# EAGLE design WirelessTransceiverUSB_RevA (EAGLE 9.6.2)

## Sheet 1 of 2
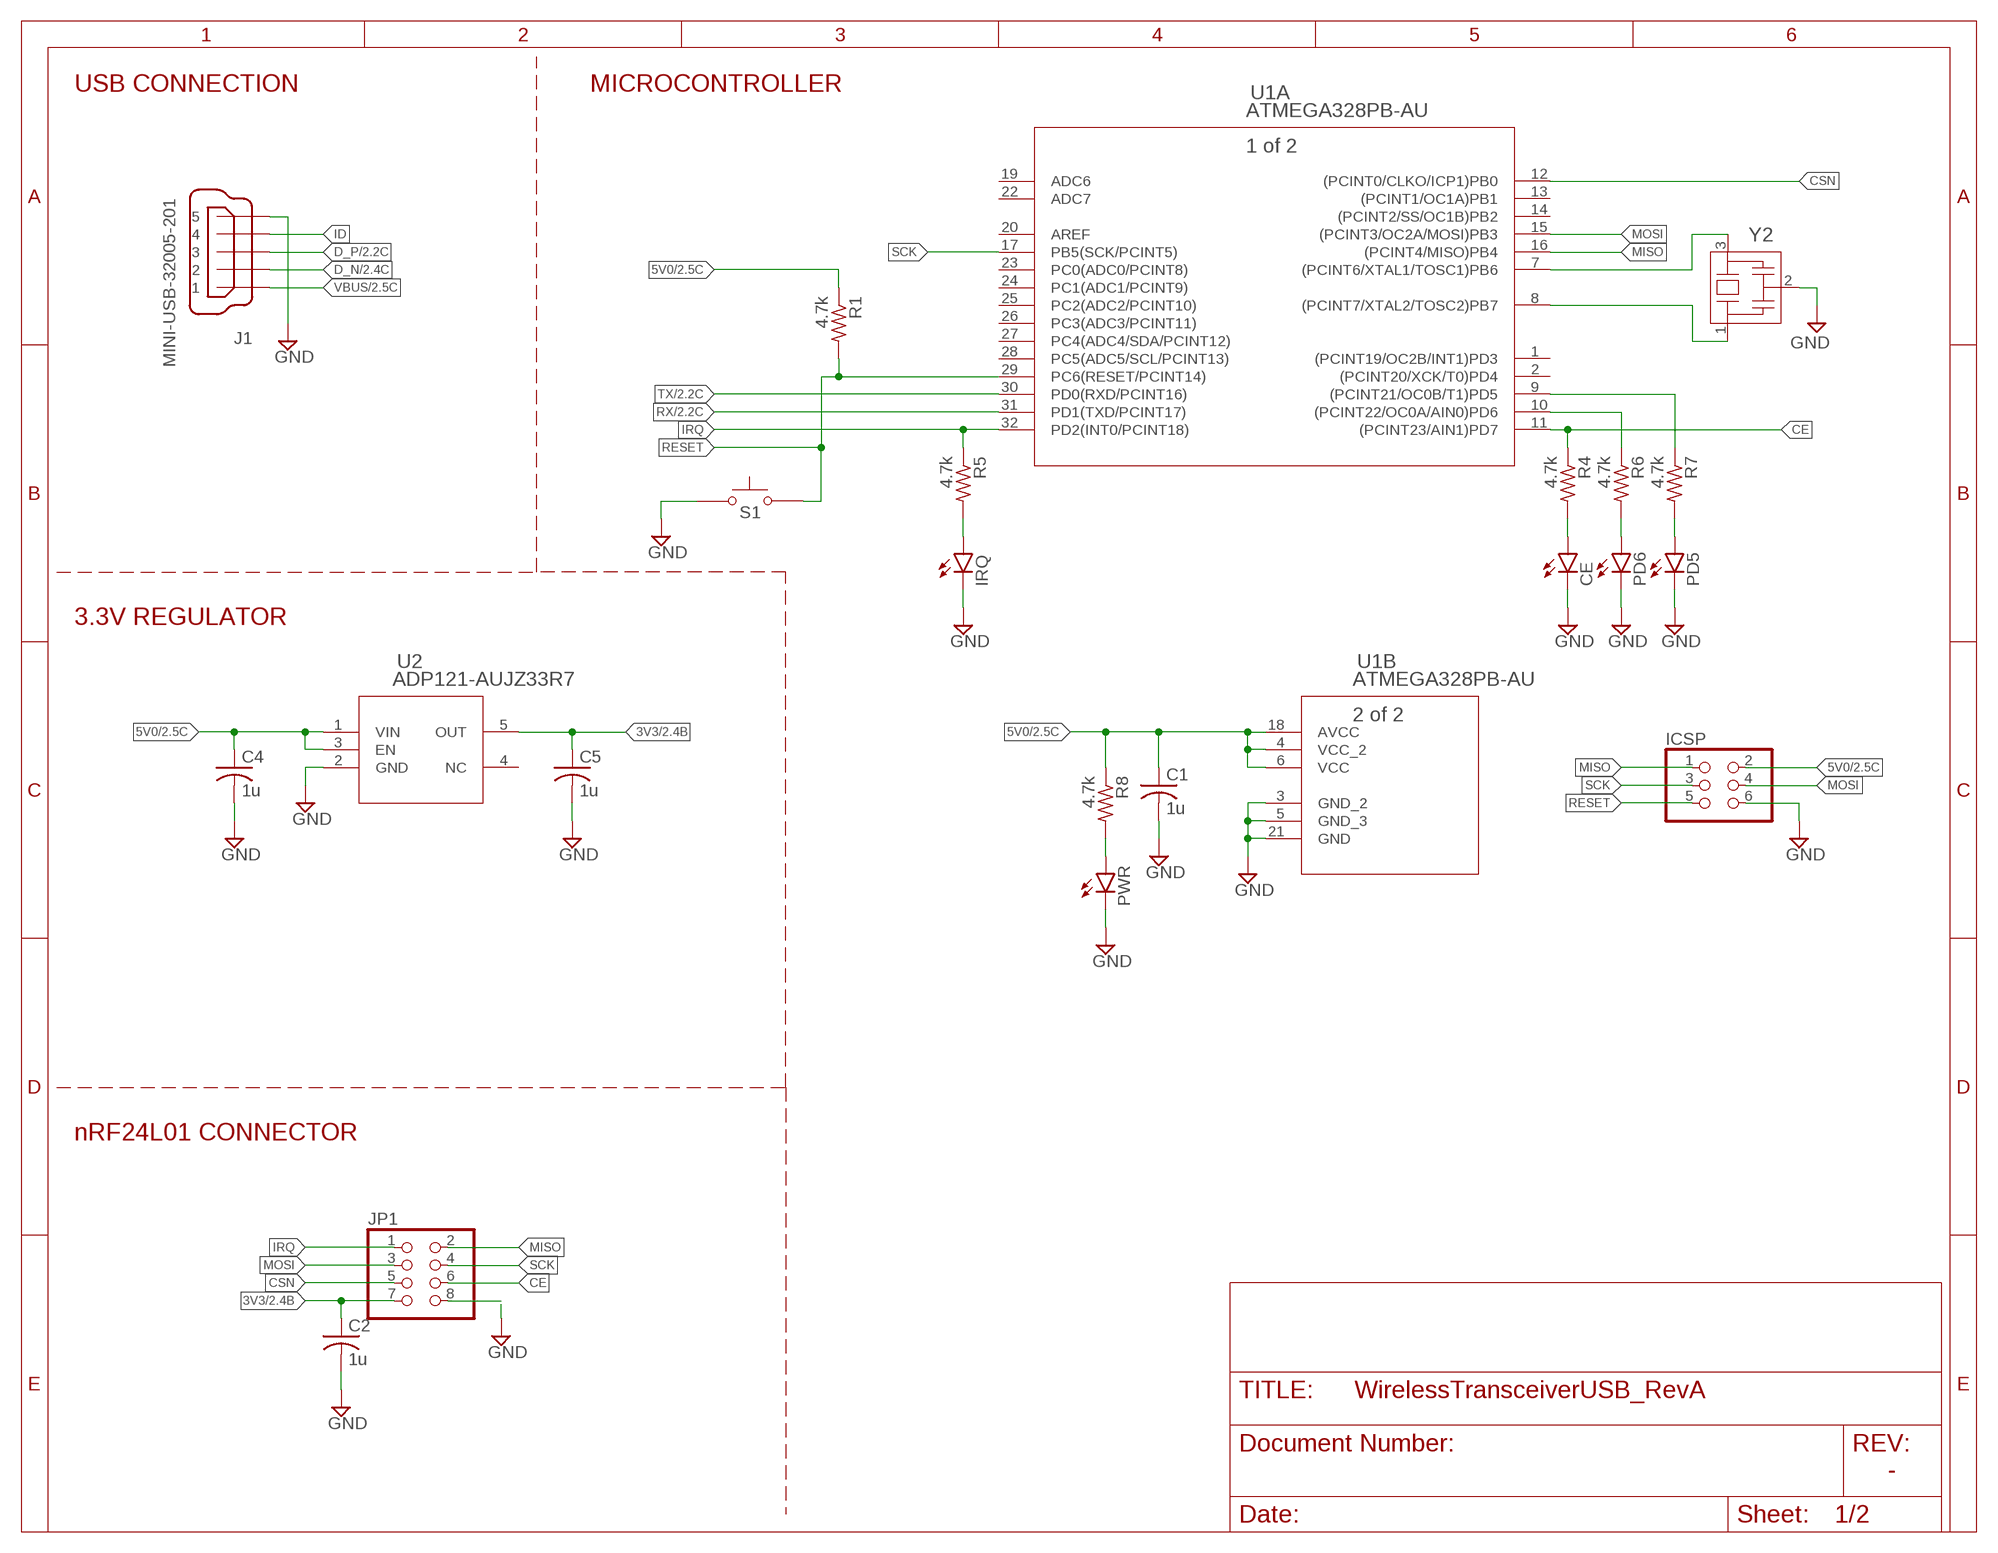
[diagram p0: schematic, sheet 1]

### Parts
C1  1u  C-USC0805  [C0805]
C2  1u  C-USC0805  [C0805]
C4  1u  C-USC0805  [C0805]
C5  1u  C-USC0805  [C0805]
CE  LEDSML0805  [SML0805]
ICSP  PINHD-2X3  [2X03]
IRQ  LEDSML0805  [SML0805]
J1  MINI-USB-32005-201  [32005-201]
JP1  PINHD-2X4  [2X04]
PD5  LEDSML0805  [SML0805]
PD6  LEDSML0805  [SML0805]
PWR  LEDSML0805  [SML0805]
R1  4.7k  R-US_R0805  [R0805]
R4  4.7k  R-US_R0805  [R0805]
R5  4.7k  R-US_R0805  [R0805]
R6  4.7k  R-US_R0805  [R0805]
R7  4.7k  R-US_R0805  [R0805]
R8  4.7k  R-US_R0805  [R0805]
S1  TL3315NF100Q  [SW_TL3315NF100Q]
U1  ATMEGA328PB-AU  [32A_MCH]
U2  ADP121-AUJZ33R7  [UJ_5_ADI]
Y2  CSTNE16M0V530000R0  [CSTNE16M0V530000R0_MUR]

### Nets
3V3: C2.1 C5.1 JP1.7 U2.5(OUT) ; also sheet 2
5V0: C1.1 C4.1 ICSP.2 R1.1 R8.1 U1.4(B:VCC_2) U1.6(B:VCC) U1.18(B:AVCC) U2.1(VIN) U2.3(EN) ; also sheet 2
CE: JP1.6 R4.1 U1.11(A:(PCINT23/AIN1)PD7)
CSN: JP1.5 U1.12(A:(PCINT0/CLKO/ICP1)PB0)
D_N [diff]: J1.2 ; also sheet 2
D_P [diff]: J1.3 ; also sheet 2
GND: C1.2 C2.2 C4.2 C5.2 CE.C ICSP.6 IRQ.C J1.5 JP1.8 PD5.C PD6.C PWR.C S1.1 S1.2 U1.3(B:GND_2) U1.5(B:GND_3) U1.21(B:GND) U2.2(GND) Y2.2 ; also sheet 2
ID: J1.4
IRQ: JP1.1 R5.1 U1.32(A:PD2(INT0/PCINT18))
MISO: ICSP.1 JP1.2 U1.16(A:(PCINT4/MISO)PB4)
MOSI: ICSP.4 JP1.3 U1.15(A:(PCINT3/OC2A/MOSI)PB3)
N$2: U1.7(A:(PCINT6/XTAL1/TOSC1)PB6) Y2.3
N$3: U1.8(A:(PCINT7/XTAL2/TOSC2)PB7) Y2.1
N$5: CE.A R4.2
N$6: IRQ.A R5.2
N$7: PD5.A R7.2
N$8: PD6.A R6.2
N$9: PWR.A R8.2
PD5: R7.1 U1.9(A:(PCINT21/OC0B/T1)PD5)
PD6: R6.1 U1.10(A:(PCINT22/OC0A/AIN0)PD6)
RESET: ICSP.5 R1.2 S1.3 S1.4 U1.29(A:PC6(RESET/PCINT14))
RX: U1.31(A:PD1(TXD/PCINT17)) ; also sheet 2
SCK: ICSP.3 JP1.4 U1.17(A:PB5(SCK/PCINT5))
TX: U1.30(A:PD0(RXD/PCINT16)) ; also sheet 2
VBUS: J1.1 ; also sheet 2
Unconnected: U1.1(A:(PCINT19/OC2B/INT1)PD3) U1.2(A:(PCINT20/XCK/T0)PD4) U1.13(A:(PCINT1/OC1A)PB1) U1.14(A:(PCINT2/SS/OC1B)PB2) U1.19(A:ADC6) U1.20(A:AREF) U1.22(A:ADC7) U1.23(A:PC0(ADC0/PCINT8)) U1.24(A:PC1(ADC1/PCINT9)) U1.25(A:PC2(ADC2/PCINT10)) U1.26(A:PC3(ADC3/PCINT11)) U1.27(A:PC4(ADC4/SDA/PCINT12)) U1.28(A:PC5(ADC5/SCL/PCINT13)) U2.4(NC)

### Notes on the sheet
- USB CONNECTION | MICROCONTROLLER
- 3.3V REGULATOR
- nRF24L01 CONNECTOR
- -

## Sheet 2 of 2
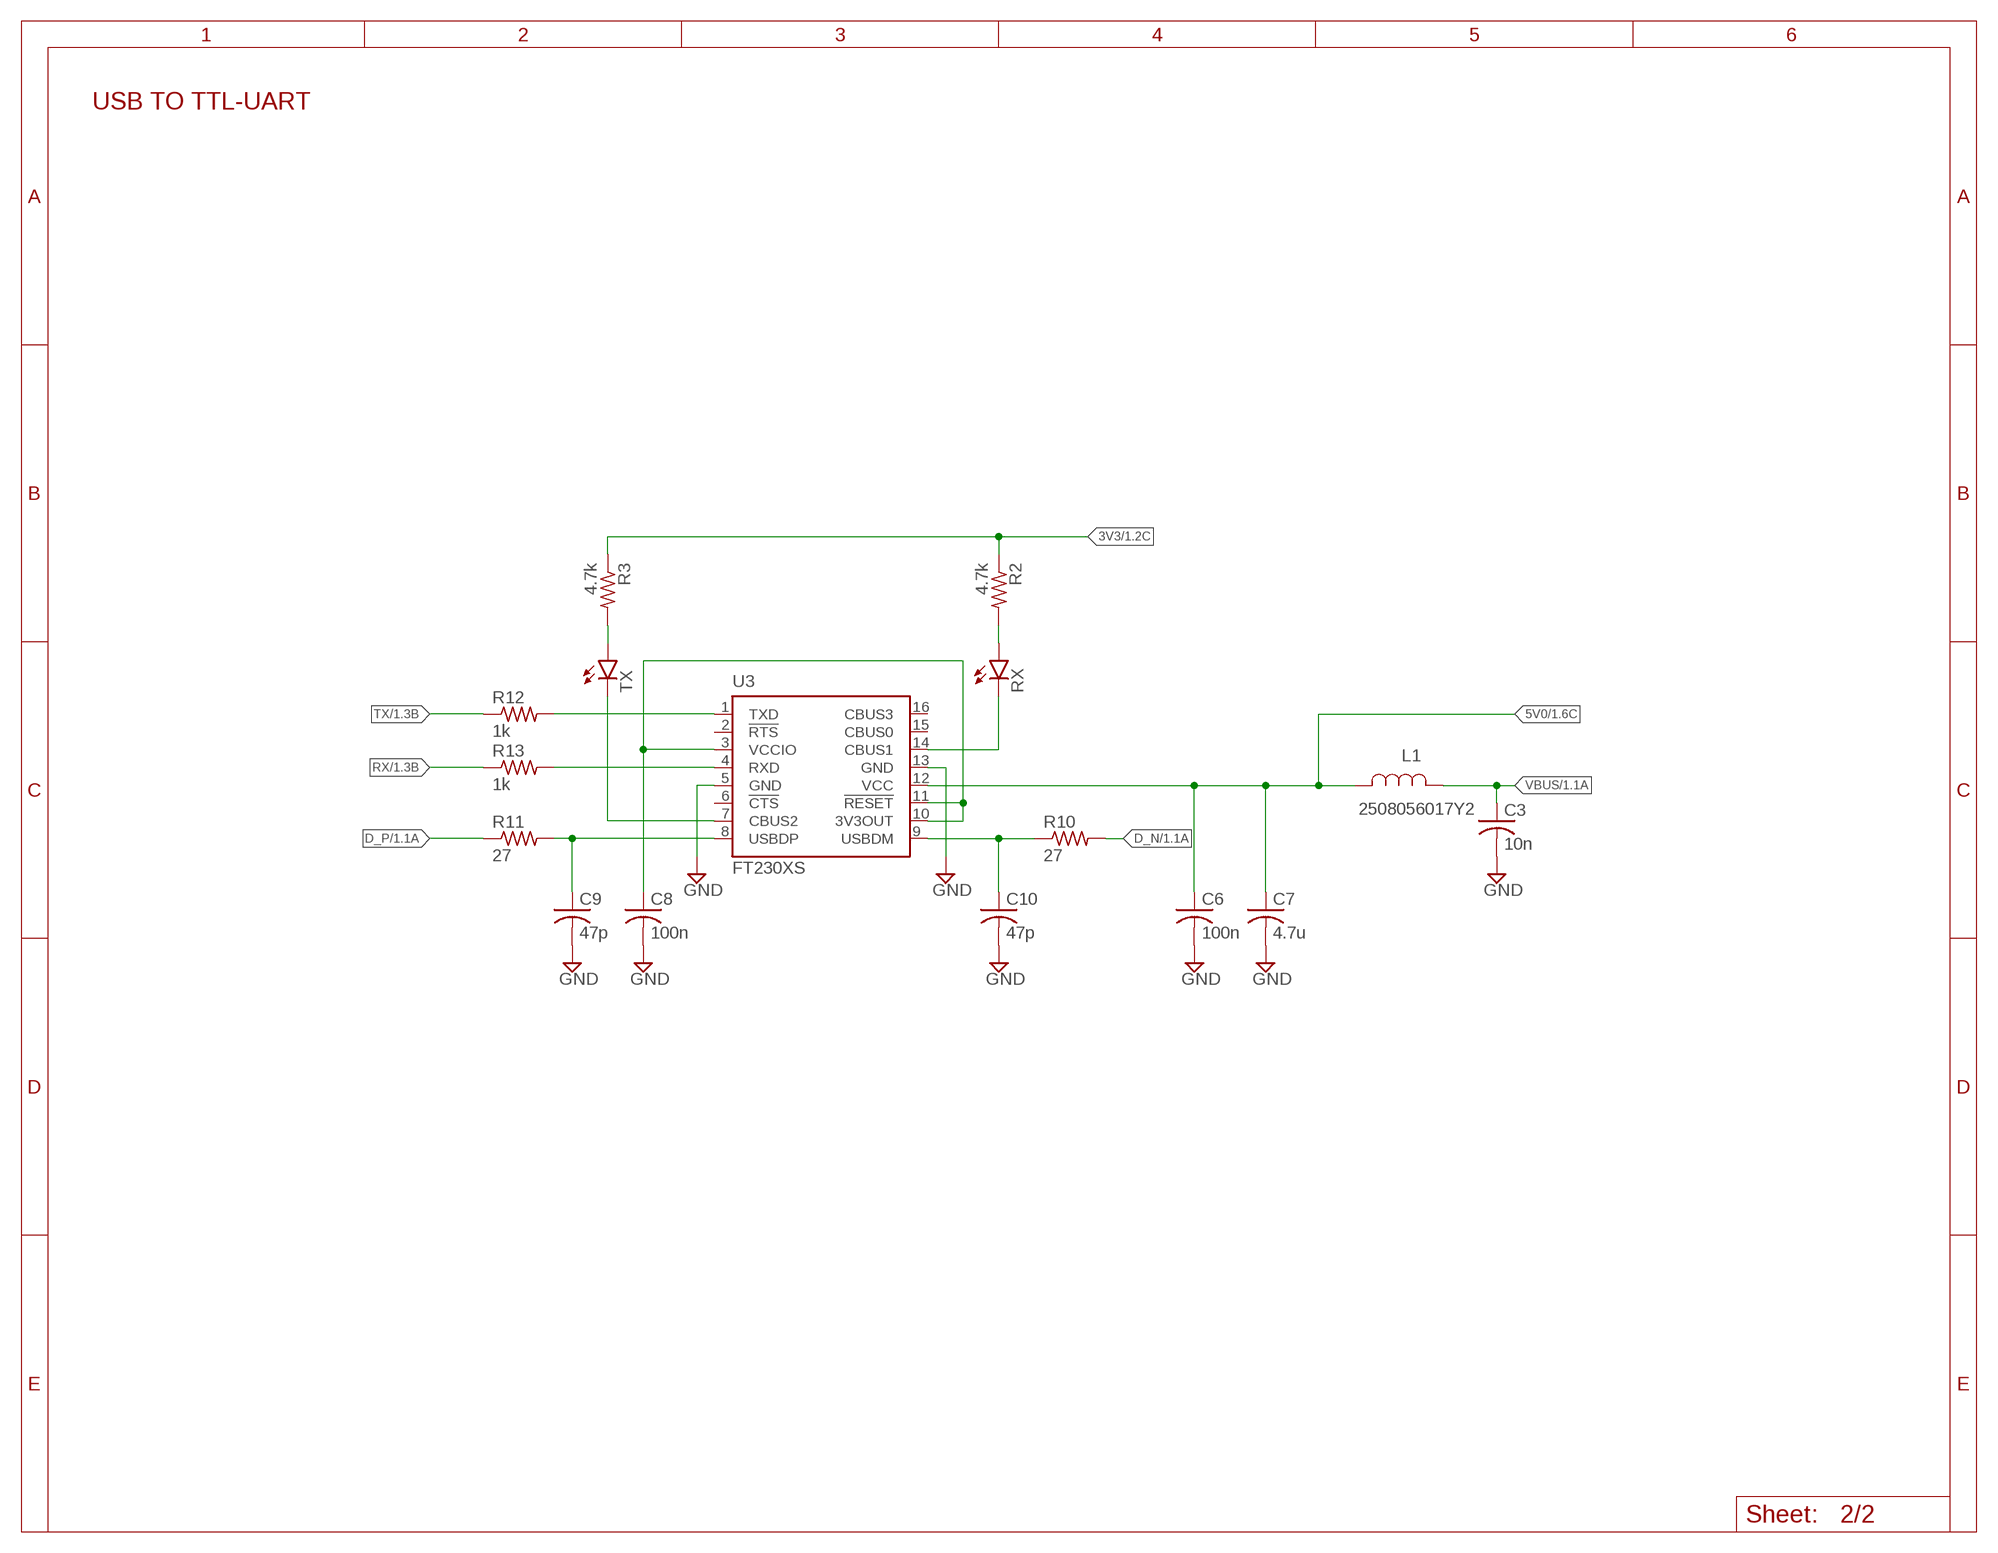
[diagram p1: schematic, sheet 2]

### Parts
C3  10n  C-USC0805  [C0805]
C6  100n  C-USC0805  [C0805]
C7  4.7u  C-USC0805  [C0805]
C8  100n  C-USC0805  [C0805]
C9  47p  C-USC0603  [C0603]
C10  47p  C-USC0603  [C0603]
L1  2508056017Y2  [IND_25_0805_FRT]
R2  4.7k  R-US_R0805  [R0805]
R3  4.7k  R-US_R0805  [R0805]
R10  27  R-US_R0603  [R0603]
R11  27  R-US_R0603  [R0603]
R12  1k  R-US_R0805  [R0805]
R13  1k  R-US_R0805  [R0805]
RX  LEDSML0805  [SML0805]
TX  LEDSML0805  [SML0805]
U3  FT230XS  [SSOP16]

### Nets
3V3: R2.1 R3.1 ; also sheet 1
5V0: C6.1 C7.1 L1.2 U3.12(VCC) ; also sheet 1
D_N [diff]: R10.2 ; also sheet 1
D_P [diff]: R11.1 ; also sheet 1
GND: C3.2 C6.2 C7.2 C8.2 C9.2 C10.2 U3.5(GND) U3.13(GND) ; also sheet 1
N$1: R2.2 RX.A
N$4: R3.2 TX.A
N$11: C8.1 U3.3(VCCIO) U3.10(3V3OUT) U3.11(!RESET)
N$13: TX.C U3.7(CBUS2)
N$14: RX.C U3.14(CBUS1)
N$15: R12.2 U3.1(TXD)
N$16: R13.2 U3.4(RXD)
RX: R13.1 ; also sheet 1
TX: R12.1 ; also sheet 1
USBD_N [diff]: C10.1 R10.1 U3.9(USBDM)
USBD_P [diff]: C9.1 R11.2 U3.8(USBDP)
VBUS: C3.1 L1.1 ; also sheet 1
Unconnected: U3.2(!RTS) U3.6(!CTS) U3.15(CBUS0) U3.16(CBUS3)

### Notes on the sheet
- USB TO TTL-UART
- Sheet:

## Library data of the parts
C1-C10 = rcl:C-US: CAPACITOR, American symbol
CE IRQ PD5 PD6 PWR RX TX = led:LED: LED OSRAM: - CHIPLED LG R971, LG N971, LY N971, LG Q971, LY Q971, LO R971, LY R971 LH N974, LH R974 LS Q976, LO Q976, LY Q976 LO Q996 - Hyper CHIPLED LW Q18S LB Q993, LB Q99A, LB R99A - SideLED LS A670, LO A670, LY A670, LG A670, LP A670 LB A673, LV A673, LT A673, LW A673 LH A674 LY A675 LS A676, LA A676, LO A676, LY A676, LW A676 LS A679, LY A679, LG A679 - Hyper Micro SIDELED® LS Y876, LA Y876, LO Y876, LY Y876 LT Y87S - SmartLED LW L88C, LW L88S LB L89C, LB L89S, LG L890 LS L89K, LO L89K, LY L89K LS L896, LA L896, LO L896, LY L896 - TOPLED LS T670, LO T670, LY T670, LG T670, LP T670 LSG T670, LSP T670, LSY T670, LOP T670, LYG T670 LG T671, LOG T671, LSG T671 LB T673, LV T673, LT T673, LW T673 LH T674 LS T676, LA T676, LO T676, LY T676, LB T676, LH T676, LSB T676, LW T676 LB T67C, LV T67C, LT T67C, LS T67K, LO T67K, LY T67K, LW E67C LS E67B, LA E67B, LO E67B, LY E67B, LB E67C, LV E67C, LT E67C LW T67C LS T679, LY T679, LG T679 LS T770, LO T770, LY T770, LG T770, LP T770 LB T773, LV T773, LT T773, LW T773 LH T774 LS E675, LA E675, LY E675, LS T675 LS T776, LA T776, LO T776, LY T776, LB T776 LHGB T686 LT T68C, LB T68C - Hyper Mini TOPLED® LB M676 - Mini TOPLED Santana® LG M470 LS M47K, LO M47K, LY M47K Source: http://www.osram.convergy.de LUXEON: - LUMILED® LXK2-PW12-R00, LXK2-PW12-S00, LXK2-PW14-U00, LXK2-PW14-V00 LXK2-PM12-R00, LXK2-PM12-S00, LXK2-PM14-U00 LXK2-PE12-Q00, LXK2-PE12-R00, LXK2-PE12-S00, LXK2-PE14-T00, LXK2-PE14-U00 LXK2-PB12-K00, LXK2-PB12-L00, LXK2-PB12-M00, LXK2-PB14-N00, LXK2-PB14-P00, LXK2-PB14-Q00 LXK2-PR12-L00, LXK2-PR12-M00, LXK2-PR14-Q00, LXK2-PR14-R00 LXK2-PD12-Q00, LXK2-PD12-R00, LXK2-PD12-S00 LXK2-PH12-R00, LXK2-PH12-S00 LXK2-PL12-P00, LXK2-PL12-Q00, LXK2-PL12-R00 Source: www.luxeon.com KINGBRIGHT: KA-3528ASYC Source: www.kingbright.com
ICSP = pinhead:PINHD-2X3: PIN HEADER
J1 = con-cypressindustries:MINI-USB-: MINI USB-B Conector Source: www.cypressindustries.com; OC_FARNELL: unknown; OC_NEWARK: unknown
JP1 = pinhead:PINHD-2X4: PIN HEADER
L1 = rcl:2508056017Y2; COPYRIGHT: Copyright (C) 2023 Ultra Librarian. All rights reserved.; MANUFACTURER_PART_NUMBER: 2508056017Y2; MFR_NAME: Fair-Rite
R1-R8 R10-R13 = rcl:R-US_: RESISTOR, American symbol
S1 = TL3315NF100Q:TL3315NF100Q: Tactile Switch SPST-NO Top Actuated Surface Mount Check prices <https://pricing.snapeda.com/parts/TL3315NF100Q/E-Switch/view-part?ref=eda> Check prices <https://pricing.snapeda.com/parts/TL3315NF100Q/E-Switch/view-part?ref=eda> Check availability <https://pricing.snapeda.com/parts/TL3315NF100Q/E-Switch/view-part?ref=eda>; AVAILABILITY: In Stock; DESCRIPTION: Tactile Switch SPST-NO Top Actuated Surface Mount; MF: E-Switch; MP: TL3315NF100Q; PACKAGE: None; PRICE: None; PURCHASE-URL: https://pricing.snapeda.com/search/part/TL3315NF100Q/?ref=eda
U1 = microchip:ATMEGA328PB-AU; COPYRIGHT: Copyright (C) 2023 Ultra Librarian. All rights reserved.; MANUFACTURER_PART_NUMBER: ATMEGA328PB-AU; MFR_NAME: Microchip
U2 = linear:ADP121-AUJZ33R7; COPYRIGHT: Copyright (C) 2023 Ultra Librarian. All rights reserved.; MANUFACTURER_PART_NUMBER: ADP121-AUJZ33R7; MFR_NAME: Analog Devices Inc
U3 = ftdichip:FT230X: USB to BASIC UART IC Auto generated by make-symbol-device-package-bsdl.ulp Rev. 43 Source: Data sheet <http://www.ftdichip.com/Support/Documents/DataSheets/ICs/DS_FT230X.pdf>
Y2 = murata:CSTNE16M0V530000R0; COPYRIGHT: Copyright (C) 2023 Ultra Librarian. All rights reserved.; MANUFACTURER_PART_NUMBER: CSTNE16M0V530000R0; MFR_NAME: Murata

## Net classes
1 diff: width 0.152 mm

## Board
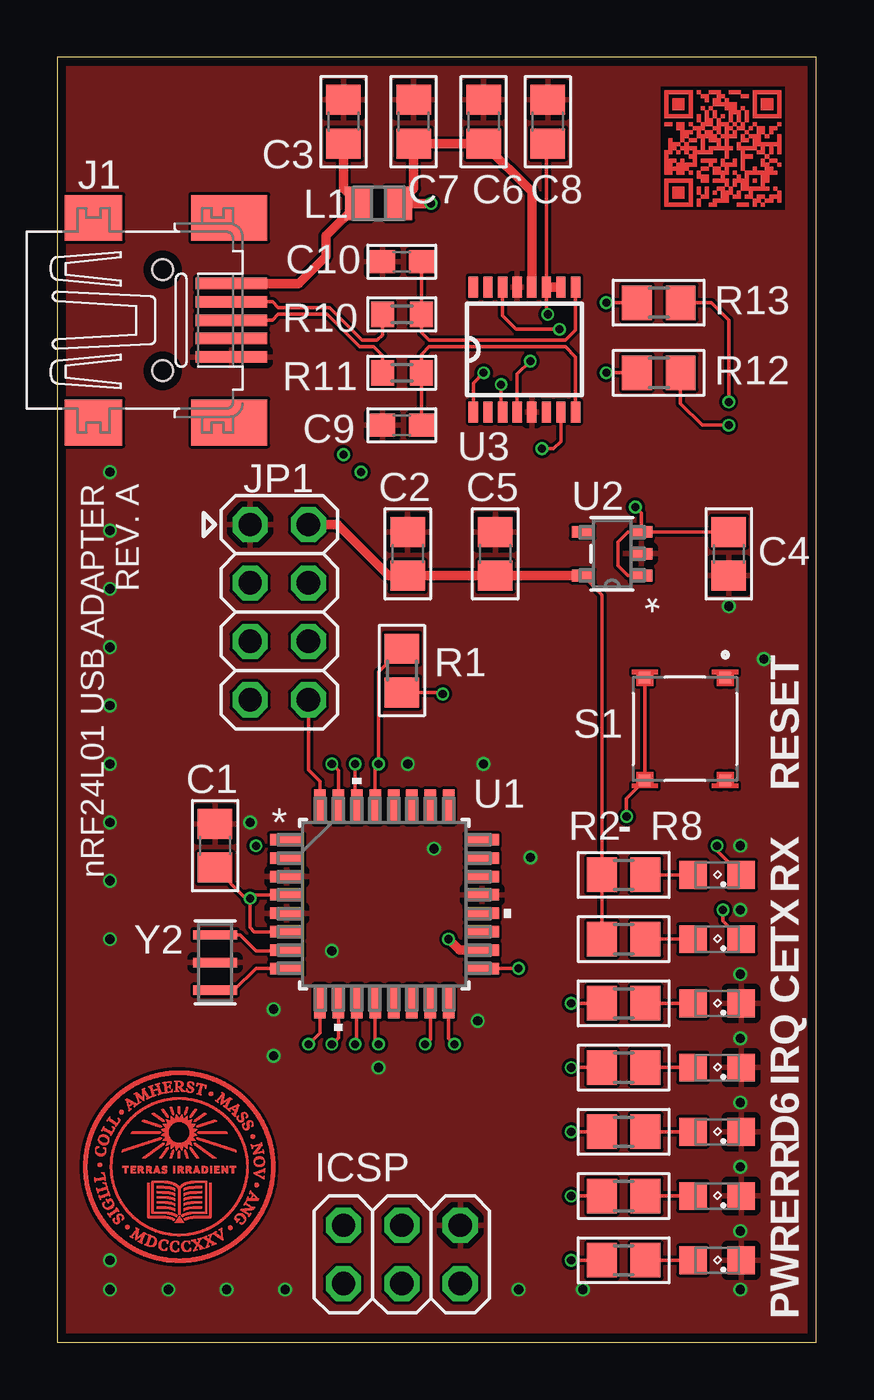
[diagram p2: board, top side]
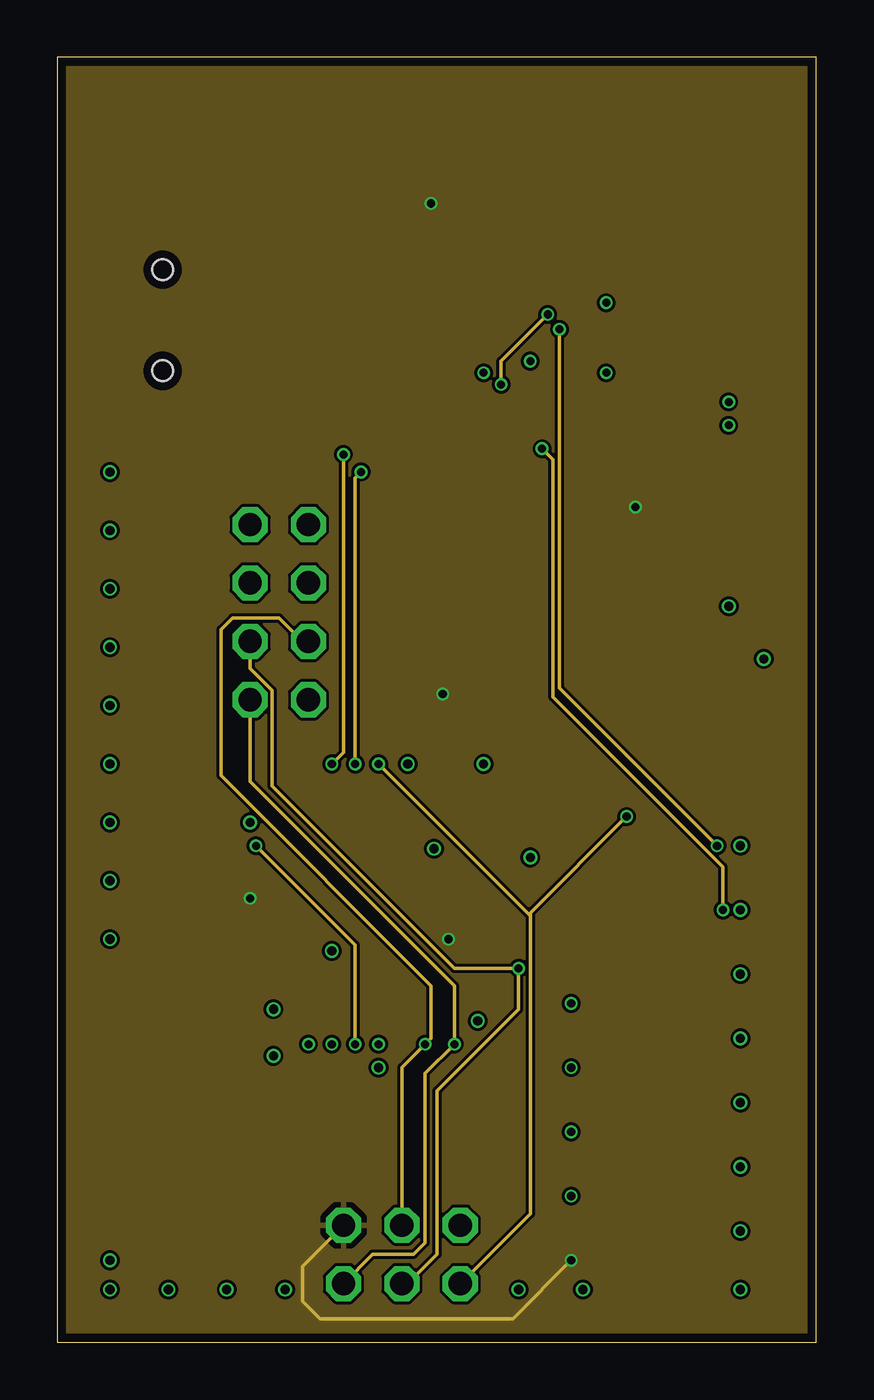
[diagram p3: board, inner layer Route2]
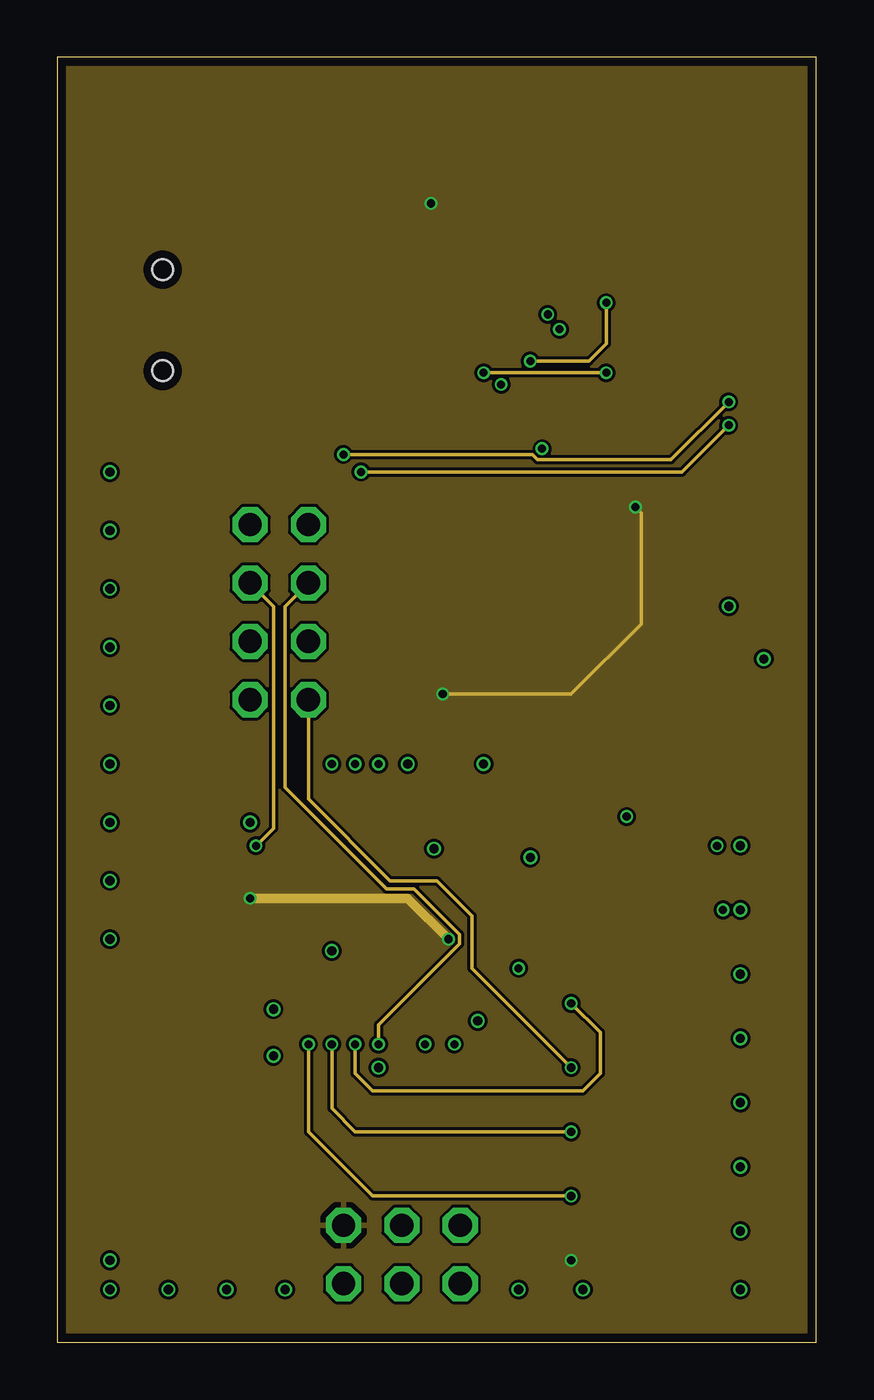
[diagram p4: board, inner layer Route15]
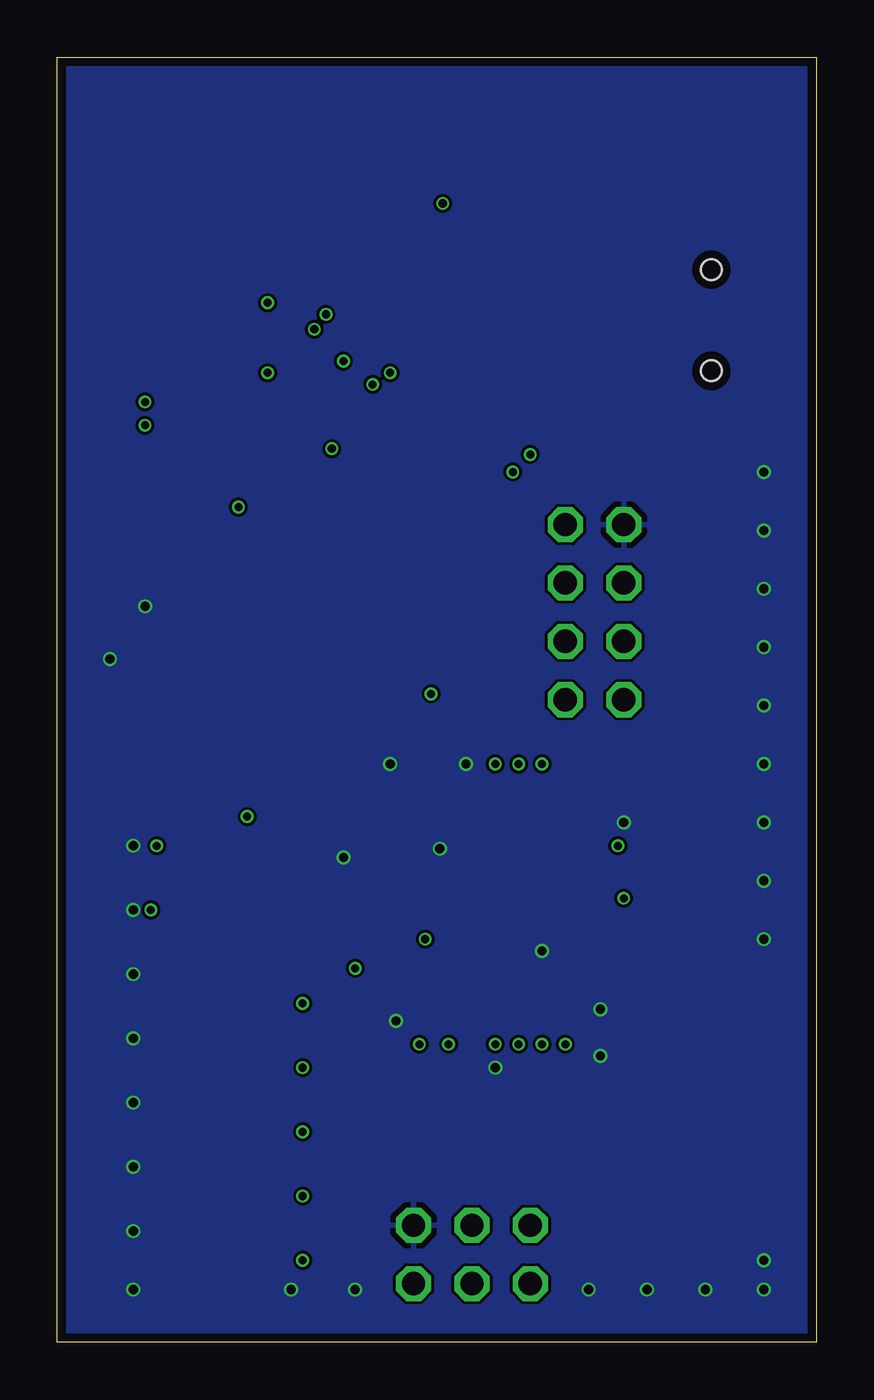
[diagram p5: board, bottom side, seen from below]

Size 33.02 x 55.88 mm. Coordinates in mm from the lower left corner, seen from the top.
Outline: 0,0 33.02,0 33.02,55.88 0,55.88 0,0
Copper layers (1*2*15*16): Top 0.035559375mm / dielectric 0.17018125mm / Route2 0.01778125mm / dielectric 47mil / Route15 0.01778125mm / dielectric 0.17018125mm / Bottom 0.035559375mm
Design rules "oshpark-4layer *": minimum track width 5mil, minimum drill 10mil, track to track 5mil, track to pad 5mil, pad to pad 5mil, via to via 5mil, smd to smd 5mil, copper to edge 15mil, drill to drill 6mil, minimum pad ring 4mil, minimum via ring 4mil, stop-mask expansion 1.5mil, vias tented up to drill 20mil, thermal gap 10mil
tRestrict: area 4,6.3 to 6.6,8.9; area 26.3,49.3 to 31.7,54.6

### Footprints (pad centres in the part's own frame; a part is rotated, then mirrored left to right if it is on the bottom)
C0805 = smd 1.3 x 1.5: 1 -0.95,0; 2 0.95,0
C0603 = smd 1.1 x 1: 1 -0.85,0; 2 0.85,0
SML0805 = smd 1.2 x 1.2: A 1.05,0; C -1.05,0
2X03 = drill 1.016 octagon: 1 -2.54,-1.27; 2 -2.54,1.27; 3 0,-1.27; 4 0,1.27; 5 2.54,-1.27; 6 2.54,1.27
32005-201 = smd 3.1 x 0.5: 1 3,1.6; 2 3,0.8; 3 3,0; 4 3,-0.8; 5 3,-1.6 | smd 2.5 x 2: M1 -3,-4.45; M2 -3,4.45 | smd 3.3 x 2: M3 2.9,4.45; M4 2.9,-4.45 | hole 0.9: 0,2.2; 0,-2.2
2X04 = drill 1.016 octagon: 1 -3.81,-1.27; 2 -3.81,1.27; 3 -1.27,-1.27; 4 -1.27,1.27; 5 1.27,-1.27; 6 1.27,1.27; 7 3.81,-1.27; 8 3.81,1.27
IND_25_0805_FRT = smd 1.168 x 1.448: 1 -0.876,0; 2 0.876,0
R0805 = smd 1.3 x 1.5: 1 -0.95,0; 2 0.95,0
R0603 = smd 1 x 1.1: 1 -0.85,0; 2 0.85,0
SW_TL3315NF100Q = smd 0.5 x 0.5: 1 -2.23,1.75; 2 2.23,1.75; 3 -2.23,-1.75; 4 2.23,-1.75
32A_MCH = smd 1.461 x 0.501: 1 -4.25,2.8; 2 -4.25,2; 3 -4.25,1.2; 4 -4.25,0.4; 5 -4.25,-0.4; 6 -4.25,-1.2; 7 -4.25,-2; 8 -4.25,-2.8; 17 4.25,-2.8; 18 4.25,-2; 19 4.25,-1.2; 20 4.25,-0.4; 21 4.25,0.4; 22 4.25,1.2; 23 4.25,2; 24 4.25,2.8 | smd 0.501 x 1.461: 9 -2.8,-4.25; 10 -2,-4.25; 11 -1.2,-4.25; 12 -0.4,-4.25; 13 0.4,-4.25; 14 1.2,-4.25; 15 2,-4.25; 16 2.8,-4.25; 25 2.8,4.25; 26 2,4.25; 27 1.2,4.25; 28 0.4,4.25; 29 -0.4,4.25; 30 -1.2,4.25; 31 -2,4.25; 32 -2.8,4.25
UJ_5_ADI = smd 0.953 x 0.508: 1 -1.276,0.95; 2 -1.276,0; 3 -1.276,-0.95; 4 1.276,-0.95; 5 1.276,0.95
SSOP16 = smd 0.914 x 0.406: 1 -2.718,2.223; 2 -2.718,1.587; 3 -2.718,0.953; 4 -2.718,0.318; 5 -2.718,-0.318; 6 -2.718,-0.953; 7 -2.718,-1.587; 8 -2.718,-2.223; 9 2.718,-2.223; 10 2.718,-1.587; 11 2.718,-0.953; 12 2.718,-0.318; 13 2.718,0.318; 14 2.718,0.953; 15 2.718,1.587; 16 2.718,2.223
CSTNE16M0V530000R0_MUR = smd 0.406 x 1.905: 1 -1.2,0; 2 0,0; 3 1.2,0

### Placement (x,y rotation side)
C1  6.86,21.59 90 top
C2  15.24,34.29 90 top
C3  12.45,53.09 90 top
C4  29.21,34.29 270 top
C5  19.05,34.29 90 top
C6  18.54,53.09 90 top
C7  15.49,53.09 90 top
C8  21.34,53.09 90 top
C9  14.99,39.88 180 top
C10  14.99,46.99 180 top
CE  28.7,14.73 180 top
ICSP  14.99,3.81 0 top
IRQ  28.7,11.94 180 top
J1  4.57,44.45 0 top
JP1  9.65,31.75 90 top
L1  13.97,49.53 0 top
PD5  28.7,6.35 180 top
PD6  28.7,9.14 180 top
PWR  28.7,3.56 180 top
R1  14.99,29.21 90 top
R2  24.64,20.32 0 top
R3  24.64,17.53 0 top
R4  24.64,14.73 0 top
R5  24.64,11.94 0 top
R6  24.64,9.14 0 top
R7  24.64,6.35 0 top
R8  24.64,3.56 0 top
R10  14.99,44.7 180 top
R11  14.99,42.16 0 top
R12  26.16,42.16 180 top
R13  26.16,45.21 180 top
RX  28.7,20.32 180 top
S1  27.3,26.67 270 top
TX  28.7,17.53 180 top
U1  14.22,19.05 0 top
U2  24.13,34.29 180 top
U3  20.32,43.18 90 top
Y2  6.86,16.51 90 top

### Tracks (layer width: path | path; a pad name or v marks a point on that pad's centre or on a via)
3V3
  Top 0.152: R3.1 R2.1 23.69,32.51 U2.5
  Top 0.406: U2.5 C5.1 C2.1 14.41,33.34 12.19,35.56 JP1.7
5V0  (via drill 0.35)
  Top 0.152: R8.1 v22.35,3.56 | U2.3 C4.1 | U2.3 25.41,36.06 v25.15,36.32 | U2.1 24.83,33.34 24.38,33.78 24.38,34.8 24.83,35.24 U2.3 | U1.4 8.53,19.45 v8.38,19.3 | U1.6 8.57,17.85 8.38,18.03 v8.38,19.3 | C1.1 8.19,19.3 v8.38,19.3 | R1.1 16.7,28.26 v16.76,28.19
  Top 0.406: U1.18 17.49,17.05 v17.02,17.53 | U3.12 20.64,50.04 C6.1 C7.1 15.49,50.18 L1.2 v16.26,49.53
  Route2 0.152: v22.35,3.56 19.81,1.02 11.43,1.02 10.67,1.78 10.67,3.3 ICSP.2
  Route15 0.152: v16.76,28.19 22.35,28.19 25.4,31.24 25.4,36.07 v25.15,36.32
  Route15 0.406: v17.02,17.53 15.24,19.3 v8.38,19.3
  pour Route2: 0,0 33.02,0 33.02,55.88 0,55.88
  pour Route15: 0,0 33.02,0 33.02,55.88 0,55.88
CE  (via drill 0.35)
  Top 0.152: U1.11 13.02,13.02 v12.95,12.95 | R4.1 v22.35,14.73
  Route2 0.152: v8.64,21.59 12.95,17.27 v12.95,12.95
  Route15 0.152: v22.35,14.73 23.62,13.46 23.62,11.68 22.86,10.92 13.72,10.92 12.95,11.68 v12.95,12.95 | JP1.6 9.4,32 9.4,22.35 v8.64,21.59
CSN  (via drill 0.35)
  Top 0.152: U1.12 13.82,13.1 v13.97,12.95
  Route15 0.152: JP1.5 9.91,32 9.91,24.13 14.33,19.71 15.51,19.71 17.5,17.72 17.5,17.33 13.97,13.8 v13.97,12.95
D_N
  Top 0.152: R10.2 14.14,43.8 13.91,43.57 13.26,43.57 11.85,44.99 9.61,44.99 9.35,45.25 J1.2
D_P
  Top 0.152: R11.1 14.14,42.91 13.76,43.29 13.15,43.29 11.73,44.71 9.61,44.71 9.35,44.45 J1.3
GND  (via drill 0.4)
  other vias: 15.24,25.15 18.54,25.15 20.57,21.08 18.29,13.97 13.97,11.94 9.4,12.45 9.4,14.48 30.73,29.72 29.21,32 29.72,21.59 29.72,18.8 29.72,16 29.72,13.21 29.72,10.41 29.72,7.62 29.72,4.83 29.72,2.29 8.38,22.61 2.29,17.53 2.29,20.07 2.29,22.61 2.29,25.15 2.29,27.69 2.29,30.23 2.29,32.77 2.29,35.31 2.29,37.85 2.29,3.56 2.29,2.29 4.83,2.29 7.37,2.29 9.91,2.29 20.07,2.29 22.86,2.29 11.94,17.02 16.38,21.46
  pour Bottom: 0,55.88 33.02,55.88 33.02,0 0,0
  pour Top: 33.02,55.88 0,55.88 0,0 33.02,0
IRQ  (via drill 0.35)
  Top 0.152: U1.32 11.42,24.39 10.92,24.89 JP1.1 | R5.1 v22.35,11.94
  Route15 0.152: v22.35,11.94 18.03,16.26 18.03,18.54 16.51,20.07 14.48,20.07 10.92,23.62 JP1.1
MISO  (via drill 0.35)
  Top 0.152: U1.16 17.02,13.2 v17.27,12.95
  Route2 0.152: ICSP.1 13.72,3.81 15.49,3.81 16,4.32 16,11.68 v17.27,12.95 17.27,15.49 8.38,24.38 JP1.2
MOSI  (via drill 0.35)
  Top 0.152: U1.15 16.22,13.18 v16,12.95
  Route2 0.152: ICSP.4 14.99,11.94 v16,12.95 16.26,13.21 16.26,15.49 7.11,24.64 7.11,30.99 7.62,31.5 9.65,31.5 10.67,30.48 JP1.3
N$1
  Top 0.152: R2.2 RX.A
N$2
  Top 0.152: Y2.3 7.94,17.71 8.64,17.02 9.94,17.02 U1.7
N$3
  Top 0.152: Y2.1 7.69,15.31 8.64,16.26 U1.8
N$4
  Top 0.152: R3.2 TX.A
N$5
  Top 0.152: R4.2 CE.A
N$6
  Top 0.152: R5.2 IRQ.A
N$7
  Top 0.152: R7.2 PD5.A
N$8
  Top 0.152: R6.2 PD6.A
N$9
  Top 0.152: R8.2 PWR.A
N$11  (via drill 0.35)
  Top 0.152: v21.34,44.7 21.27,44.77 U3.11 21.27,52.07 C8.1 | v19.3,41.66 19.3,40.53 U3.3
  Top 0.406: U3.11 U3.10
  Route2 0.152: v21.34,44.7 19.3,42.67 v19.3,41.66
N$13  (via drill 0.35)
  Top 0.152: TX.C 28.96,18.32 v28.96,18.8 | v21.08,38.86 21.59,38.86 21.91,39.18 U3.7
  Route2 0.152: v21.08,38.86 21.57,38.38 21.57,28.05 28.96,20.66 v28.96,18.8
N$14  (via drill 0.35)
  Top 0.152: U3.14 19.37,44.64 19.95,44.05 v21.84,44.05 | v28.7,21.59 28.7,21.37 RX.C
  Route2 0.152: v21.84,44.05 21.84,28.45 v28.7,21.59
N$15  (via drill 0.35)
  Top 0.152: U3.1 18.1,41.72 v18.54,42.16 | v23.88,42.16 R12.2
  Route15 0.152: v18.54,42.16 v23.88,42.16
N$16  (via drill 0.35)
  Top 0.152: U3.4 20,42.1 v20.57,42.67 | v23.88,45.21 R13.2
  Route15 0.152: v20.57,42.67 23.11,42.67 23.88,43.43 v23.88,45.21
PD5  (via drill 0.35)
  Top 0.152: U1.9 11.42,13.46 v10.92,12.95 | R7.1 v22.35,6.35
  Route15 0.152: v22.35,6.35 13.72,6.35 10.92,9.14 v10.92,12.95
PD6  (via drill 0.35)
  Top 0.152: U1.10 12.22,13.24 v11.94,12.95 | R6.1 v22.35,9.14
  Route15 0.152: v22.35,9.14 12.95,9.14 11.94,10.16 v11.94,12.95
RESET  (via drill 0.35)
  Top 0.152: U1.29 13.82,25 v13.97,25.15 13.97,29.14 R1.2 | v24.77,22.86 24.77,23.65 S1.4 S1.3
  Route2 0.152: ICSP.5 20.57,5.59 20.57,18.54 | 20.57,18.54 v13.97,25.15 | 20.57,18.54 20.57,18.67 v24.77,22.86
RX  (via drill 0.35)
  Top 0.152: U1.31 12.22,24.86 v11.94,25.15 | v29.21,40.89 29.21,44.45 28.45,45.21 R13.1
  Route2 0.152: v11.94,25.15 12.45,25.65 v12.45,38.61
  Route15 0.152: v12.45,38.61 20.66,38.61 20.88,38.38 26.7,38.38 v29.21,40.89
SCK  (via drill 0.35)
  Top 0.152: U1.17 v20.07,16.26
  Route2 0.152: ICSP.3 15.24,2.54 16.51,3.81 16.51,10.92 20.07,14.48 v20.07,16.26 17.27,16.26 9.35,24.18 9.35,28.34 8.38,29.3 JP1.4
TX  (via drill 0.35)
  Top 0.152: U1.30 12.95,23.37 v12.95,25.15 | v29.21,39.88 28.07,39.88 27.11,40.83 R12.1
  Route2 0.152: v12.95,25.15 12.95,37.59 v13.21,37.85
  Route15 0.152: v13.21,37.85 27.18,37.85 v29.21,39.88
USBD_N
  Top 0.152: U3.9 22.54,44.02 22.1,43.57 16.17,43.57 15.84,43.91 R10.1 C10.1
USBD_P
  Top 0.152: U3.8 22.54,42.85 22.1,43.29 16.17,43.29 15.84,42.96 R11.2 C9.1
VBUS
  Top 0.406: J1.1 10.49,46.05 11.68,47.24 11.68,48.12 L1.1 12.45,50.18 C3.1
(copper drawn outside any net)
  shapes: Top area x8489

### Text on the board
tPlace: nRF24L01 USB ADAPTER / REV. A | RESET | - | RX | TX | CE | IRQ | D6 | ERR | PWR